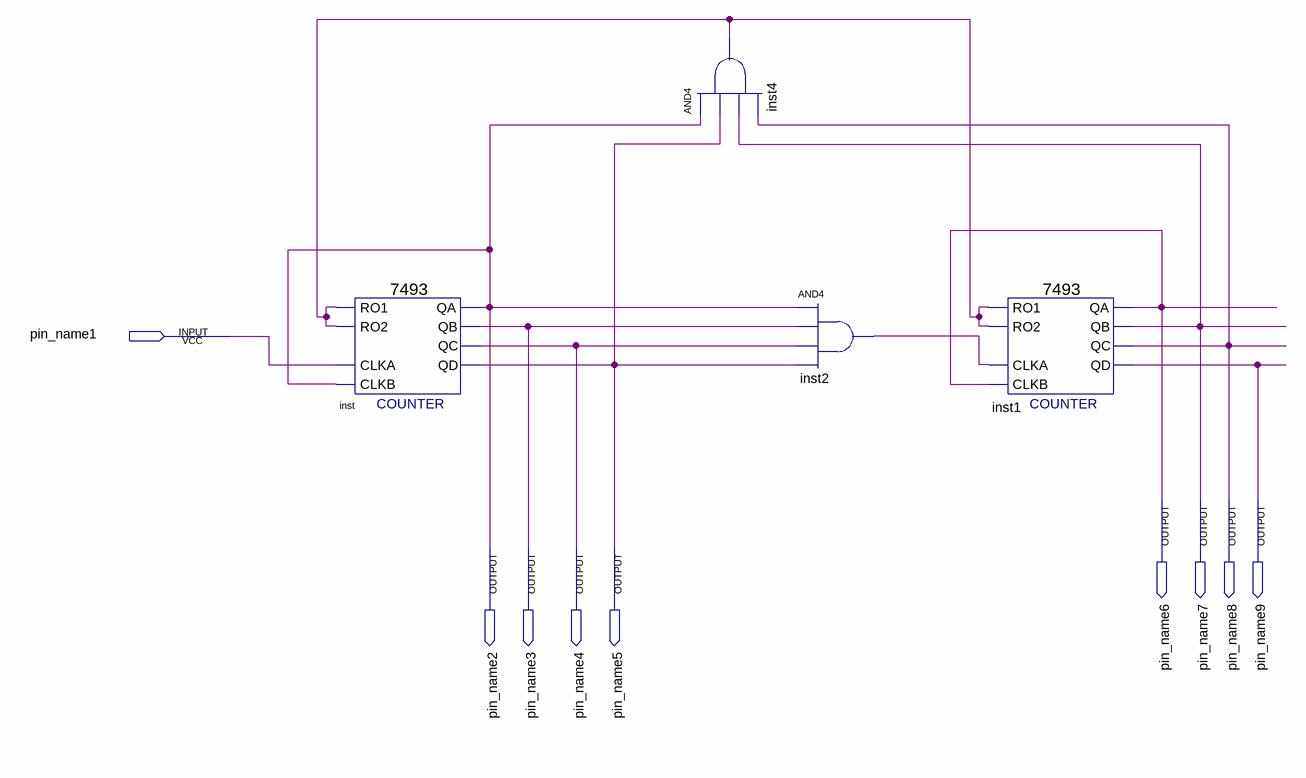
[diagram p0: schematic sheet]
// Quartus schematic licznik7943.bdf as structural Verilog: 4 symbols, 9 pins
module licznik7943 (
  input  pin_name1,
  output pin_name6,
  output pin_name7,
  output pin_name8,
  output pin_name9,
  output pin_name2,
  output pin_name3,
  output pin_name4,
  output pin_name5
);

  wire inst2_out, inst4_out;

  \7493  inst (
    .RO1(inst4_out), .RO2(inst4_out), .CLKA(pin_name1), .CLKB(pin_name2), .QC(pin_name4), .QB(pin_name3),
    .QA(pin_name2), .QD(pin_name5));
  and inst4 (inst4_out, pin_name2, pin_name5, pin_name7, pin_name8);
  and inst2 (inst2_out, pin_name2, pin_name3, pin_name4, pin_name5);
  \7493  inst1 (
    .RO1(inst4_out), .RO2(inst4_out), .CLKA(inst2_out), .CLKB(pin_name6), .QC(pin_name8), .QB(pin_name7),
    .QA(pin_name6), .QD(pin_name9));
endmodule
